# EAGLE schematic WAirU_v1.1 (EAGLE 8.5.0)
COMPANY: ADAFRUIT INDUSTRIES; DRAWN: KTOWN; REV: B

## Sheet 1 of 2
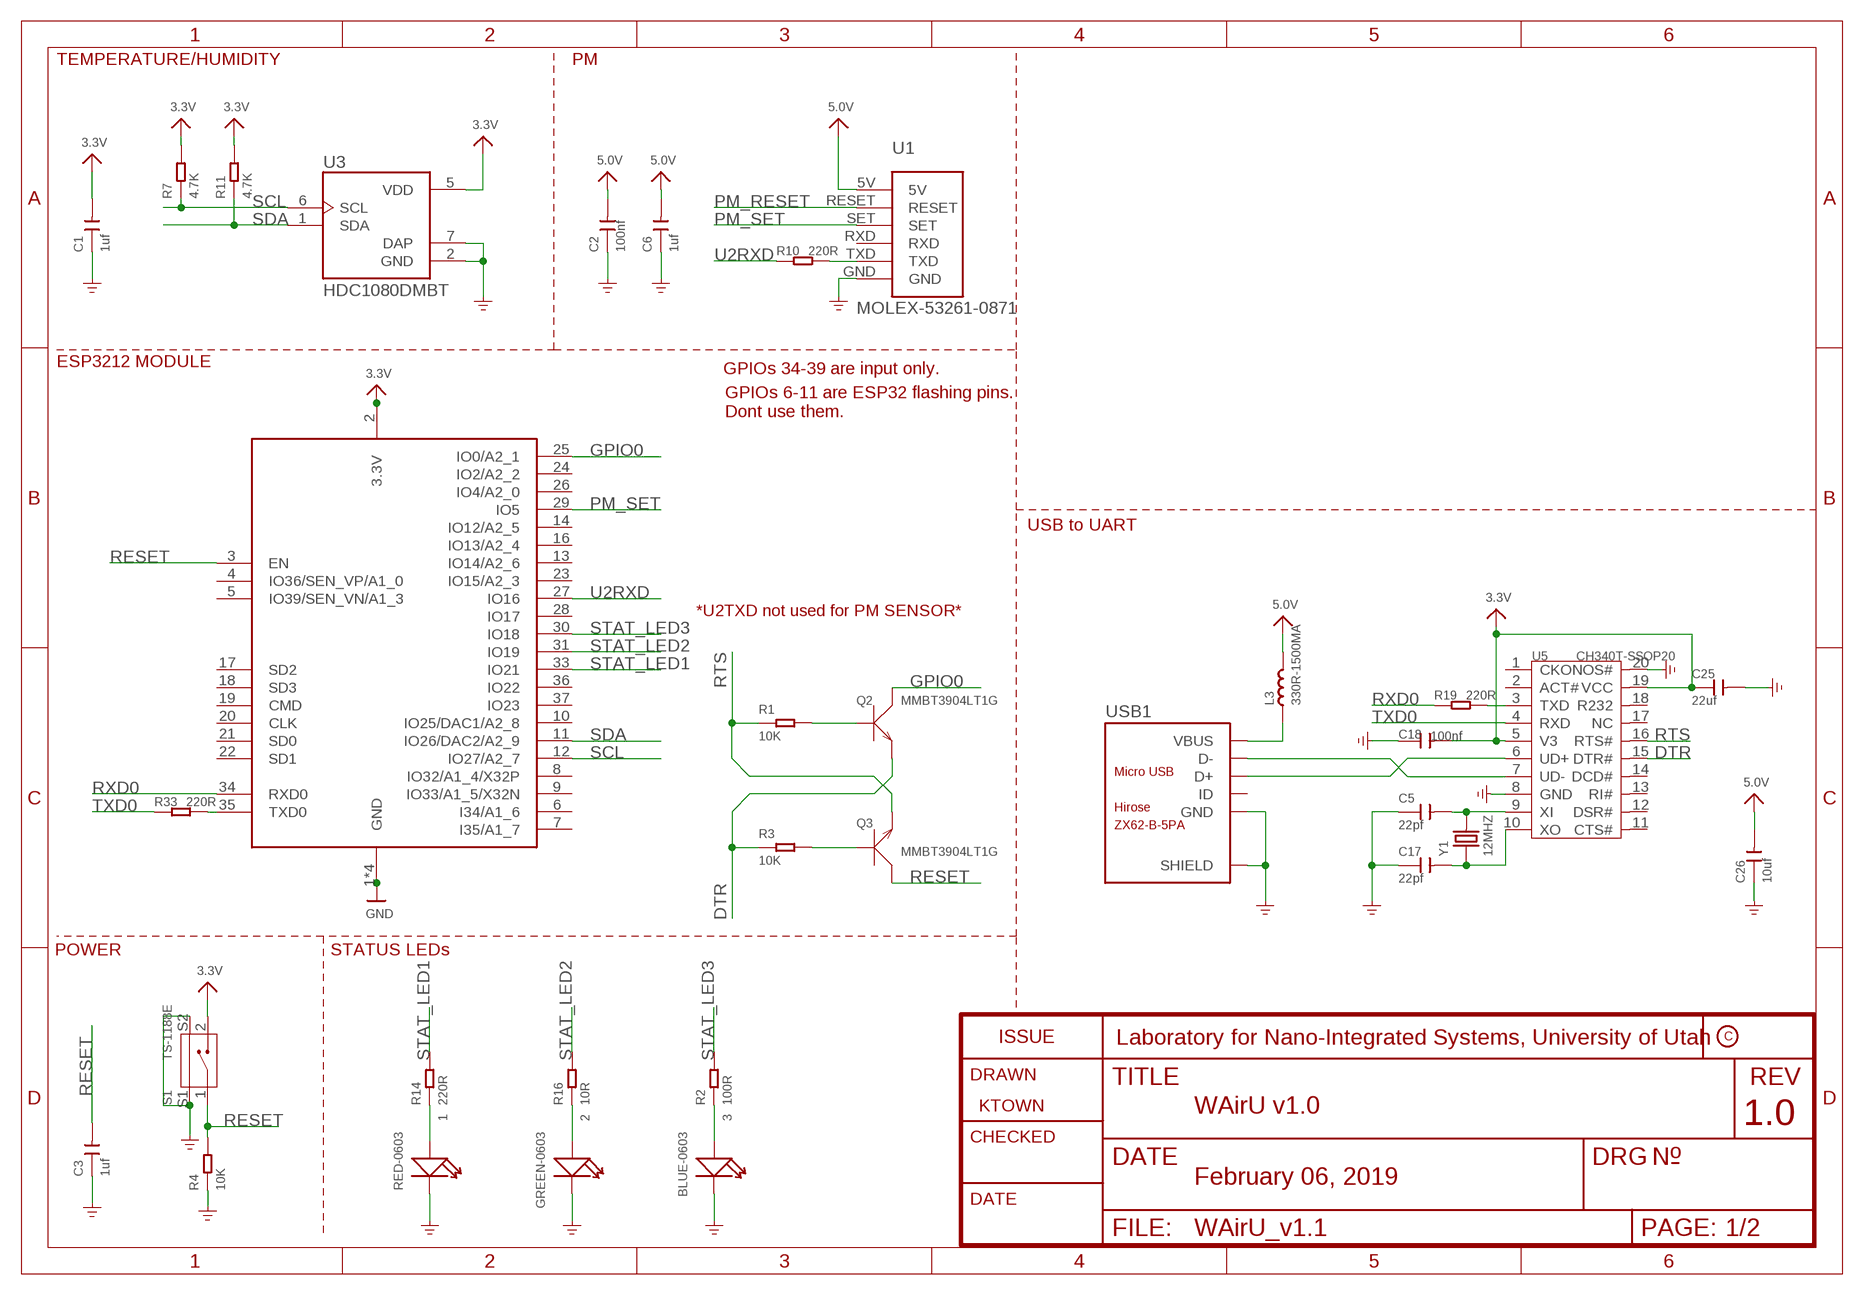
[diagram p0: schematic, sheet 1]
FRAME1 (FRAME_A4): COMPANY: TETRAD: SENSOR NETWORK SOLUTIONS, LLC; REV: 1.0

### Parts
1  RED-0603  LED-SMD-RED-DIFFUSED(0603)  [LED-0603]
2  GREEN-0603  SMD-LED-CLEAR-GREEN(0603)  [LED-0603]
3  BLUE-0603  SMD-LED-CLEAR-BLUE(0603)  [LED-0603]
C1  1uf  CERAMIC-1UF-25V-10%-X7R(0603)  [C0603]
C2  100nf  CERAMIC-100NF-50V-10%-X7R(0603)  [C0603]
C3  1uf  CERAMIC-1UF-25V-10%-X7R(0603)  [C0603]
C5  22pf  CERAMIC-22PF-50V-5%-NPO(0603)  [C0603]
C6  1uf  CERAMIC-1UF-25V-10%-X7R(0603)  [C0603]
C17  22pf  CERAMIC-22PF-50V-5%-NPO(0603)  [C0603]
C18  100nf  CERAMIC-100NF-50V-10%-X7R(0603)  [C0603]
C25  22uf  CERAMIC-22UF-6.3V-20%-X5R(0805)  [C0805]
C26  10uf  CERAMIC-10UF-10V-10%-X5R(0603)  [C0603]
L3  330R-1500MA  SMD-FERRITE-BEAD-330R-1500MA(0805)'0805'  [L0805]
Q2  MMBT3904LT1G  SMD-TRANSISTORS-NPN-40V-200MA-MMBT3904LT1G(SOT-23)  [SOT-23]
Q3  MMBT3904LT1G  SMD-TRANSISTORS-NPN-40V-200MA-MMBT3904LT1G(SOT-23)  [SOT-23]
R1  10K  SMD-RES-10K-1%-1/10W(0603)  [R0603]
R2  100R  SMD-RES-100R-5%-1/10W(0603)  [R0603]
R3  10K  SMD-RES-10K-1%-1/10W(0603)  [R0603]
R4  10K  SMD-RES-10K-1%-1/10W(0603)  [R0603]
R7  4.7K  SMD-RES-4.7K-5%-1/10W(0603)  [R0603]
R10  220R  SMD-RES-220R-5%-1/10W(0603)  [R0603]
R11  4.7K  SMD-RES-4.7K-5%-1/10W(0603)  [R0603]
R14  220R  SMD-RES-220R-5%-1/10W(0603)  [R0603]
R16  10R  SMD-RES-10R-5%-1/10W(0603)  [R0603]
R19  220R  SMD-RES-220R-5%-1/10W(0603)  [R0603]
R33  220R  SMD-RES-220R-5%-1/10W(0603)  [R0603]
S1  TS-1188E  SMD-BUTTON(2+2P-7X3.5MM-90D)  [SW4-SMD-7.0X3.5X3.5MM-90D]
U1  MOLEX-53261-0871  [MOLEX-53261-0871]
U3  HDC1080DMBT  [SON100P300X300X80-7N]
U5  CH340T-SSOP20  INTERFACE-CH340T(SSOP20)  [SSOP20-0.65-7.6X5.2MM]
U7  ESP32_WROOM32_SKINNY  [WROOM32_SKINNY]
USB1  ZX62-B-5PA  MICRO-USB-SMD(ZX62-B-5PA)  [MICRO-USB5+6P-SMD-0.65-AB]
Y1  12MHZ  SMD-CRYSTAL-12MHZ-20PF-20PPM-40R(2P-5.0X3.2MM)  [X2-SMD-5.0X3.2X1.3MM]

### Nets
3.3V: C1.2 C18.2 C25.1 R7.2 R11.2 S1.2 U3.5(VDD) U5.5(V3) U5.19(VCC) U7.2(3.3V) ; also sheet 2
5.0V: C2.2 C6.2 C26.2 L3.2 U1.5V ; also sheet 2
DTR: Q2.2(E) R3.1 U5.15(DTR#)
GND: 1.- 2.- 3.- C1.1 C2.1 C3.1 C5.1 C6.1 C17.1 C18.1 C25.2 C26.1 R4.1 S1.S1 S1.S2 U1.GND U3.2(GND) U3.7(DAP) U5.8(GND) U5.20(NOS#) U7.1(GND) U7.15(GND) U7.38(GND) U7.P$1(GND) USB1.5(GND) USB1.P1(SHIELD) USB1.P2(SHIELD) USB1.P3_1(SHIELD) USB1.P3_2(SHIELD) USB1.P3_3(SHIELD) USB1.P4_1(SHIELD) USB1.P4_2(SHIELD) USB1.P4_3(SHIELD) USB1.P5(SHIELD) USB1.P6(SHIELD) ; supply symbol labelled GND_POWER ; also sheet 2
GPIO0: Q2.3(C) U7.25(IO0/A2_1)
N$1: 2.+ R16.1
N$7: 1.+ R14.1
N$12: Q3.1(B) R3.2
N$13: Q2.1(B) R1.2
N$20: R10.2 U1.TXD
N$22: 3.+ R2.1
N$24: U5.7(UD-) USB1.2(D-)
N$25: U5.6(UD+) USB1.3(D+)
N$26: C5.2 U5.9(XI) Y1.2
N$27: C17.2 U5.10(XO) Y1.1
N$28: R19.2 U5.3(TXD)
N$33: R33.2 U7.35(TXD0)
PM_RESET: U1.RESET
PM_SET: U1.SET U7.29(IO5)
RESET: C3.2 Q3.3(C) R4.2 S1.1 U7.3(EN)
RTS: Q3.2(E) R1.1 U5.16(RTS#)
RXD0: R19.1 U7.34(RXD0)
SCL: R7.1 U3.6(SCL) U7.12(IO27/A2_7)
SDA: R11.1 U3.1(SDA) U7.11(IO26/DAC2/A2_9)
STAT_LED1: R14.2 U7.33(IO21)
STAT_LED2: R16.2 U7.31(IO19)
STAT_LED3: R2.2 U7.30(IO18)
TXD0: R33.1 U5.4(RXD)
U2RXD: R10.1 U7.27(IO16)
VBUS: L3.1 USB1.1(VBUS) ; also sheet 2
Unconnected: U1.RXD U5.1(CKO) U5.2(ACT#) U5.11(CTS#) U5.12(DSR#) U5.13(RI#) U5.14(DCD#) U5.17(NC) U5.18(R232) U7.4(IO36/SEN_VP/A1_0) U7.5(IO39/SEN_VN/A1_3) U7.6(I34/A1_6) U7.7(I35/A1_7) U7.8(IO32/A1_4/X32P) U7.9(IO33/A1_5/X32N) U7.10(IO25/DAC1/A2_8) U7.13(IO14/A2_6) U7.14(IO12/A2_5) U7.16(IO13/A2_4) U7.17(SD2) U7.18(SD3) U7.19(CMD) U7.20(CLK) U7.21(SD0) U7.22(SD1) U7.23(IO15/A2_3) U7.24(IO2/A2_2) U7.26(IO4/A2_0) U7.28(IO17) U7.36(IO22) U7.37(IO23) USB1.4(ID)

### Notes on the sheet
- TEMPERATURE/HUMIDITY | PM
- ESP3212 MODULE
- GPIOs 34-39 are input only.
- GPIOs 6-11 are ESP32 flashing pins.
  Dont use them.
- USB to UART
- *U2TXD not used for PM SENSOR*
- POWER | STATUS LEDs
- Laboratory for Nano-Integrated Systems, University of Utah
- WAirU v1.0
- February 06, 2019

## Sheet 2 of 2
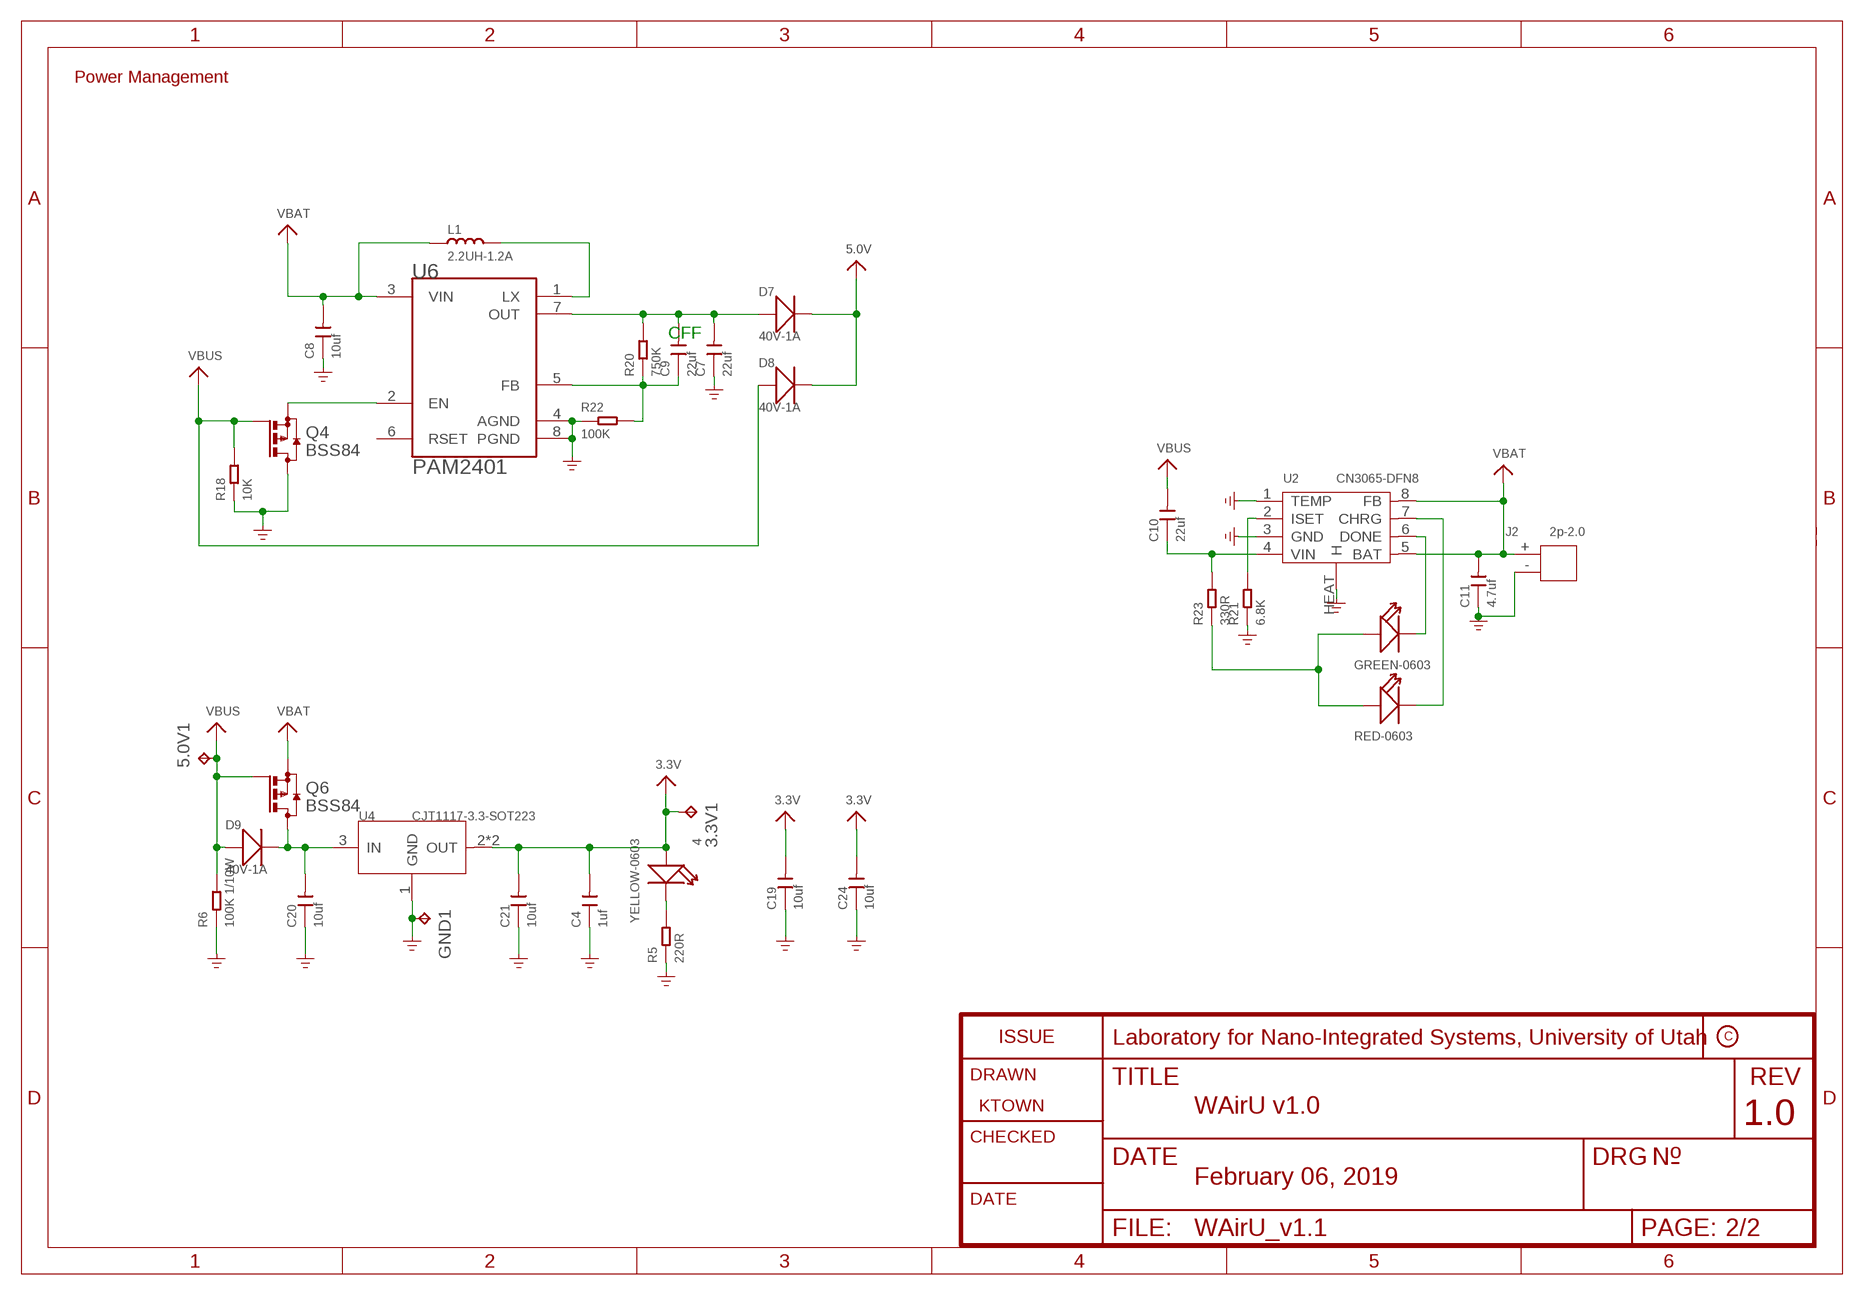
[diagram p1: schematic, sheet 2]
FRAME2 (FRAME_A4): COMPANY: TETRAD: SENSOR NETWORK SOLUTIONS, LLC; REV: 1.0
FRAME3 (FRAME_A4): COMPANY: TETRAD: SENSOR NETWORK SOLUTIONS, LLC; REV: 1.0

### Parts
3.3V1  TPTP20SQ  [TP20SQ]
4  YELLOW-0603  SMD-LED-CLEAR-YELLOW(0603)  [LED-0603]
5  GREEN-0603  SMD-LED-CLEAR-GREEN(0603)  [LED-0603]
5.0V1  TPTP20SQ  [TP20SQ]
6  RED-0603  LED-SMD-RED-DIFFUSED(0603)  [LED-0603]
C4  1uf  CERAMIC-1UF-25V-10%-X7R(0603)  [C0603]
C7  22uf  CERAMIC-10UF-10V-10%-X5R(0603)  [C0603]
C8  10uf  CERAMIC-10UF-10V-10%-X5R(0603)  [C0603]
C9  22uf  CERAMIC-10UF-10V-10%-X5R(0603)  [C0603]
C10  22uf  CERAMIC-10UF-10V-10%-X5R(0603)  [C0603]
C11  4.7uf  CERAMIC-4.7UF-10V-10%-X5R(0603)  [C0603]
C19  10uf  CERAMIC-10UF-10V-10%-X5R(0603)  [C0603]
C20  10uf  CERAMIC-10UF-10V-10%-X5R(0603)  [C0603]
C21  10uf  CERAMIC-10UF-10V-10%-X5R(0603)  [C0603]
C24  10uf  CERAMIC-10UF-10V-10%-X5R(0603)  [C0603]
D7  40V-1A  SMD-DIODE-SCHOTTKY-40V-1A(DO-214AC)  [DO-214AC]
D8  40V-1A  SMD-DIODE-SCHOTTKY-40V-1A(DO-214AC)  [DO-214AC]
D9  40V-1A  SMD-DIODE-SCHOTTKY-40V-1A(DO-214AC)  [DO-214AC]
GND1  TPTP20SQ  [TP20SQ]
J2  2p-2.0  DIP-JST-2P-2.0  [H2-2.0-6X4.5MM]
L1  2.2UH-1.2A  SMD-INDUCTOR-2.2UH-20%-1.2A(0805)  [L0805]
Q4  BSS84  [SOT23]
Q6  BSS84  [SOT23]
R5  220R  SMD-RES-220R-5%-1/10W(0603)  [R0603]
R6  100K 1/10W  SMD-RES-100K-5%-1/10W(0603)  [R0603]
R18  10K  SMD-RES-10K-1%-1/10W(0603)  [R0603]
R20  750K  SMD-RES-100K-5%-1/10W(0603)  [R0603]
R21  6.8K  SMD-RES-6.8K-1%-1/10W(0603)  [R0603]
R22  100K  SMD-RES-100K-5%-1/10W(0603)  [R0603]
R23  330R  SMD-RES-330R-1%-1/10W(0603)  [R0603]
U2  CN3065-DFN8  PMIC-CN3065(DFN8)  [DFN8G-0.5-3X3MM]
U4  CJT1117-3.3-SOT223  PMIC-CJT1117-3.3(SOT223)  [SOT-223]
U6  PAM2401  [MSOP-8]

### Nets
3.3V: 3.3V1.TP 4.+ C4.2 C19.2 C21.2 C24.2 U4.2(OUT) U4.TER(OUT) ; also sheet 1
5.0V: D7.2(-) D8.2(-) ; also sheet 1
GND: C4.1 C7.1 C8.1 C11.1 C19.1 C20.1 C21.1 C24.1 GND1.TP J2.- Q4.3(D) R5.1 R6.1 R18.1 R21.1 R22.1 U2.1(TEMP) U2.3(GND) U2.HEAT(H) U4.1(GND) U6.4(AGND) U6.8(PGND) ; supply symbol labelled GND_POWER ; also sheet 1
N$3: L1.2 U6.1(LX)
N$4: Q4.2(S) U6.2(EN)
N$5: C10.1 R23.2 U2.4(VIN)
N$6: R21.2 U2.2(ISET)
N$8: C20.2 D9.2(-) Q6.3(D) U4.3(IN)
N$9: C7.2 C9.2 D7.1(+) R20.2 U6.7(OUT)
N$10: C9.1 R20.1 R22.2 U6.5(FB)
N$11: 5.+ 6.+ R23.1
N$14: 5.- U2.6(DONE)
N$21: 4.- R5.2
N$23: 6.- U2.7(CHRG)
VBAT: C8.2 C11.2 J2.+ L1.1 Q6.2(S) U2.5(BAT) U2.8(FB) U6.3(VIN)
VBUS: 5.0V1.TP C10.2 D8.1(+) D9.1(+) Q4.1(G) Q6.1(G) R6.2 R18.2 ; also sheet 1
Unconnected: U6.6(RSET)

### Notes on the sheet
- Power Management
- CFF
- Laboratory for Nano-Integrated Systems, University of Utah
- WAirU v1.0
- February 06, 2019

## Library data of the parts
1 6 = Seeed-LED:LED-SMD-RED-DIFFUSED(0603): 304090042; MPN: 19-217-R6C-AL1M2VY-3T
2 5 = Seeed-LED:SMD-LED-CLEAR-GREEN(0603): 304090043; MPN: 19-217-G7C-AN1P2-3T
3 = Seeed-LED:SMD-LED-CLEAR-BLUE(0603): 304090045; MPN: 19-217-BHC-ZL1M2RY-3T
3.3V1 5.0V1 GND1 = testpad:TP: Test pad
4 = Seeed-LED:SMD-LED-CLEAR-YELLOW(0603): 304090044; MPN: 19-217-Y5C-AM1N1VY-3T
C1 C3 C4 C6 = Seeed-Capacitor:CERAMIC-1UF-25V-10%-X7R(0603): 302010139; MPN: CC0603KRX7R8BB105
C2 C18 = Seeed-Capacitor:CERAMIC-100NF-50V-10%-X7R(0603): 302010138; MPN: CC0603KRX7R9BB104
C5 C17 = Seeed-Capacitor:CERAMIC-22PF-50V-5%-NPO(0603): 302010143; MPN: CC0603JRNPO9BN220
C7 C9 C10 = OPL_Capacitor:CERAMIC-10UF-10V-10%-X5R(0603): 302010103; MPN: CC0603KRX5R6BB106; VALUE: 10uf
C8 = OPL_Capacitor:CERAMIC-10UF-10V-10%-X5R(0603): 302010103; MPN: CC0603KRX5R6BB106
C11 = OPL_Capacitor:CERAMIC-4.7UF-10V-10%-X5R(0603): 302010111; MPN: CC0603KRX5R6BB475
C19-C21 C24 C26 = Seeed-Capacitor:CERAMIC-10UF-10V-10%-X5R(0603): 302010103; MPN: CC0603KRX5R6BB106
C25 = Seeed-Capacitor:CERAMIC-22UF-6.3V-20%-X5R(0805): 302010171; MPN: CC0805MKX5R5BB226
D7-D9 = Seeed-Diode:SMD-DIODE-SCHOTTKY-40V-1A(DO-214AC): 304020027; MPN: 1N5819
J2 = Seeed-Connector:DIP-JST-2P-2.0: 320110049
L1 = OPL_Inductor:SMD-INDUCTOR-2.2UH-20%-1.2A(0805): 303010086; MPN: LQM2MPN2R2MG0
L3 = Seeed-Inductor:SMD-FERRITE-BEAD-330R-1500MA(0805): 303030006; MPN: BLM21PG331SN1D
Q2 Q3 = Seeed-Transistor:SMD-TRANSISTORS-NPN-40V-200MA-MMBT3904LT1G(SOT-23): 305010013; MPN: MMBT3904LT1G
Q4 Q6 = BSS84:BSS84: P-CHANNEL MOS FET; AVAILABILITY: Unavailable; DESCRIPTION: P-Channel Enhancement Mode Field Effect Transistor; MF: MICROSS/On Semiconductor; MP: BSS84; PACKAGE: SOT-23 ON Semiconductor; PRICE: None
R1 R3 R4 R18 = Seeed-Resistor:SMD-RES-10K-1%-1/10W(0603): 301010299; MPN: RC0603FR-0710KL
R2 = Seeed-Resistor:SMD-RES-100R-5%-1/10W(0603): 301010090; MPN: RC0603JR-07100RL
R5 R10 R14 R19 R33 = Seeed-Resistor:SMD-RES-220R-5%-1/10W(0603): 301010163; MPN: RC0603JR-07220RL
R6 = Seeed-Resistor:SMD-RES-100K-5%-1/10W(0603): 301010089; MPN: RC0603JR-07100KL
R7 R11 = Seeed-Resistor:SMD-RES-4.7K-5%-1/10W(0603): 301010290; MPN: RC0603JR-074K7L
R16 = Seeed-Resistor:SMD-RES-10R-5%-1/10W(0603): 301010096; MPN: RC0603JR-0710RL
R20 R22 = OPL_Resistor:SMD-RES-100K-5%-1/10W(0603): 301011975; MPN: RC0603JR-07100KL; VALUE: 100K 1/10W
R21 = Seeed-Resistor:SMD-RES-6.8K-1%-1/10W(0603): 301010198; MPN: RC0805JR-07220KL
R23 = Seeed-Resistor:SMD-RES-330R-1%-1/10W(0603): 301010300; MPN: RC0603FR-07330RL
S1 = OPL_Switch:SMD-BUTTON(2+2P-7X3.5MM-90D): 311020023; MPN: TS-1188E
U1 = Molex_53261_0871_Connector:MOLEX-53261-0871
U2 = Seeed-IC:PMIC-CN3065(DFN8): 310030101; MPN: CN3065
U3 = HDC1080DMBT_TITempHum:HDC1080DMBT: HDC1080 Low Power, High Accuracy Digital Humidity Sensor with Temperature Sensor 6-WSON -40 to 125; DESCRIPTION: HDC1080 Low Power, High Accuracy Digital Humidity Sensor with Temperature Sensor 6-WSON -40 to 125; DIGI-KEY_PART_NUMBER: 296-43864-1-ND; DIGI-KEY_PURCHASE_URL: https://www.digikey.com/product-detail/en/texas-instruments/HDC1080DMBT/296-43864-1-ND/5878615?utm_source=snapeda&utm_medium=aggregator&utm_campaign=symbol; MF: Texas Instruments; MP: HDC1080DMBT; PACKAGE: WDFN-6 Texas Instruments
U4 = Seeed-IC:PMIC-CJT1117-3.3(SOT223): 310030097; MPN: CJT1117-3.3
U5 = Seeed-IC:INTERFACE-CH340T(SSOP20): 310070026; MPN: CH340T
U6 = PAM2401_dcdcConverter:PAM2401
U7 = microbuilder:ESP32_WROOM32
USB1 = Seeed-Connector:MICRO-USB-SMD(ZX62-B-5PA): 320010005; MPN: ZX62-B-5PA
Y1 = Seeed-Crystal Oscillator:SMD-CRYSTAL-12MHZ-20PF-20PPM-40R(2P-5.0X3.2MM): 306010047; MPN: 5032/2P